# Altium schematic sheet E.SchDoc
size A
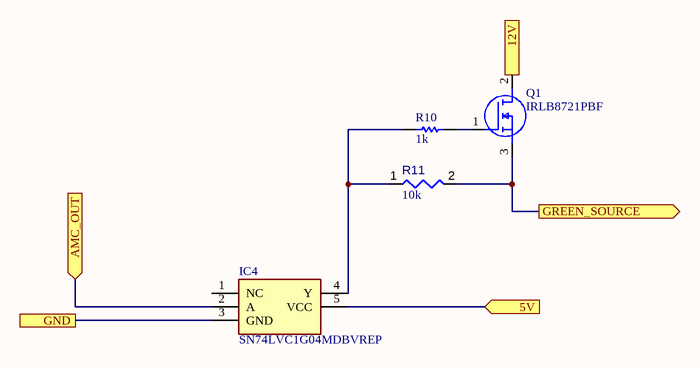
[diagram p0: E.SchDoc]

## Parts
IC4  SN74LVC1G04MDBVREP  [SOT95P280X145-5N]
Q1  IRLB8721PBF  [TO254P483X1016X1994-3P]
R10  value 1k  [RESC3116X70X50ML13T20]  (hidden comment: Resistor 1k +/-1% 1206 250 mW)
R11  value 10k  [RESC2013X50X35ML15T15]  (hidden comment: Resistor 10k +/-1% 0805 125 mW)

## Ports
5V (in), 12V (in), AMC_OUT (in), GND, GREEN_SOURCE (out)

## Nets
5V: IC4.5(VCC) ; port 5V
12V: Q1.2(D) ; port 12V
AMC_OUT: IC4.2(A) ; port AMC_OUT
GND: IC4.3(GND) ; port GND
GREEN_SOURCE: Q1.3(S) R11.2 ; port GREEN_SOURCE
NetIC4_4: IC4.4(Y) R10.1 R11.1
NetQ1_1: Q1.1(G) R10.2

Not connected (* = marked no-connect by the designer): IC4 1(NC)

## Library data of the parts
IC4 = SN74LVC1G04MDBVREP: Integrated Circuit; Manufacturer_Name: Texas Instruments; Datasheet Link: http://www.ti.com/lit/gpn/sn74lvc1g04-ep; Height: 1.45mm; Manufacturer_Part_Number: SN74LVC1G04MDBVREP; Mouser Part Number: 595-SN74LVC04MDBVREP; Mouser Price/Stock: https://www.mouser.co.uk/ProductDetail/Texas-Instruments/SN74LVC1G04MDBVREP?qs=l4wu3mKjyflWQOlEvZuvmw%3D%3D; Arrow Part Number: SN74LVC1G04MDBVREP; Arrow Price/Stock: https://www.arrow.com/en/products/sn74lvc1g04mdbvrep/texas-instruments?utm_currency=USD&region=nac
Q1 = IRLB8721PBF: MOSFET (N-Channel); Manufacturer_Name: Infineon; Datasheet Link: http://uk.rs-online.com/web/p/products/7259322; Height: 4.83mm; Manufacturer_Part_Number: IRLB8721PBF; Mouser Part Number: 942-IRLB8721PBF; Mouser Price/Stock: https://www.mouser.co.uk/ProductDetail/Infineon-Technologies/IRLB8721PBF?qs=9%252BKlkBgLFf0T58WYx%2FAl5A%3D%3D; Arrow Part Number: IRLB8721PBF; Arrow Price/Stock: https://www.arrow.com/en/products/irlb8721pbf/infineon-technologies-ag?utm_currency=USD&region=europe
R10 = CMP-009-00011-5: Chip Resistor, 1 KOhm, +/- 1%, 0.25 W, -55 to 155 degC, 1206 (3216 Metric); Voltage Rating: 200V; Power: 250mW; Max Operating Temperature: 155°C; Mounting Technology: SM; Tolerance: 1%; Case/Package: 1206; RoHS Compliant: True; Min Operating Temperature: -55°C; Pins: 2
R11 = CMP-009-00018-5: Chip Resistor, 10 KOhm, +/- 1%, 125 mW, -55 to 155 degC, 0805 (2012 Metric); Power: 125mW; Voltage Rating: 150V; Tolerance: 1%; Pins: 2; Min Operating Temperature: -55°C; Case/Package: 0805; Max Operating Temperature: 155°C; RoHS Compliant: True; Mounting Technology: SM